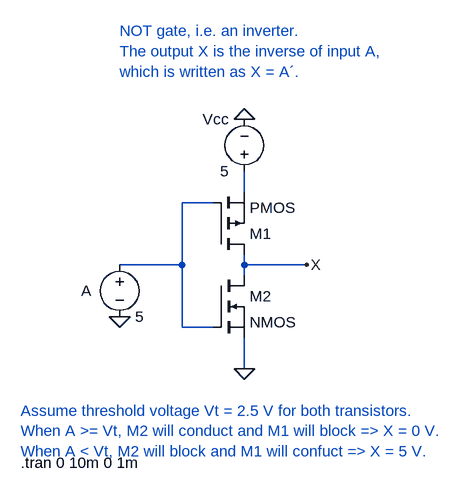
[diagram p0: schematic not_gate.asc]
not_gate.asc, the LTspice schematic file:
Version 4
SHEET 1 880 680
WIRE 256 144 256 112
WIRE 208 160 160 160
WIRE 160 256 160 160
WIRE 160 256 64 256
WIRE 256 256 256 240
WIRE 352 256 256 256
WIRE 256 272 256 256
WIRE 160 352 160 256
WIRE 208 352 160 352
WIRE 256 416 256 368
FLAG 256 32 0
FLAG 256 416 0
FLAG 64 336 0
FLAG 352 256 X
SYMBOL voltage 256 128 R180
WINDOW 0 24 96 Left 2
WINDOW 3 24 16 Left 2
WINDOW 123 0 0 Left 0
WINDOW 39 0 0 Left 0
SYMATTR InstName Vcc
SYMATTR Value 5
SYMBOL pmos 208 240 M180
SYMATTR InstName M1
SYMBOL nmos 208 272 R0
SYMATTR InstName M2
SYMBOL voltage 64 240 R0
WINDOW 0 -59 56 Left 2
WINDOW 123 0 0 Left 0
WINDOW 39 0 0 Left 0
SYMATTR InstName A
SYMATTR Value 5
TEXT 64 -104 Left 2 ;NOT gate, i.e. an inverter.\nThe output X is the inverse of input A, \nwhich is written as X = A´.
TEXT -88 480 Left 2 ;Assume threshold voltage Vt = 2.5 V for both transistors.\nWhen A >= Vt, M2 will conduct and M1 will block => X = 0 V.\nWhen A < Vt, M2 will block and M1 will confuct => X = 5 V.
TEXT -88 560 Left 2 !.tran 0 10m 0 1m

The netlist it stands for:
* not_gate.asc
Vcc N001 0 5
M1 X N002 N001 N001 PMOS
M2 X N002 0 0 NMOS
V§A N002 0 5
.model NMOS NMOS
.model PMOS PMOS
.lib standard.mos
* NOT gate, i.e. an inverter.
* The output X is the inverse of input A,
* which is written as X = A´.
* Assume threshold voltage Vt = 2.5 V for both transistors.
* When A >= Vt, M2 will conduct and M1 will block => X = 0 V.
* When A < Vt, M2 will block and M1 will confuct => X = 5 V.
.tran 0 10m 0 1m
.backanno
.end